# Altium schematic sheet 03_DUT_ICs.SchDoc
size A3; SheetNumber: 3; SheetTotal: 4
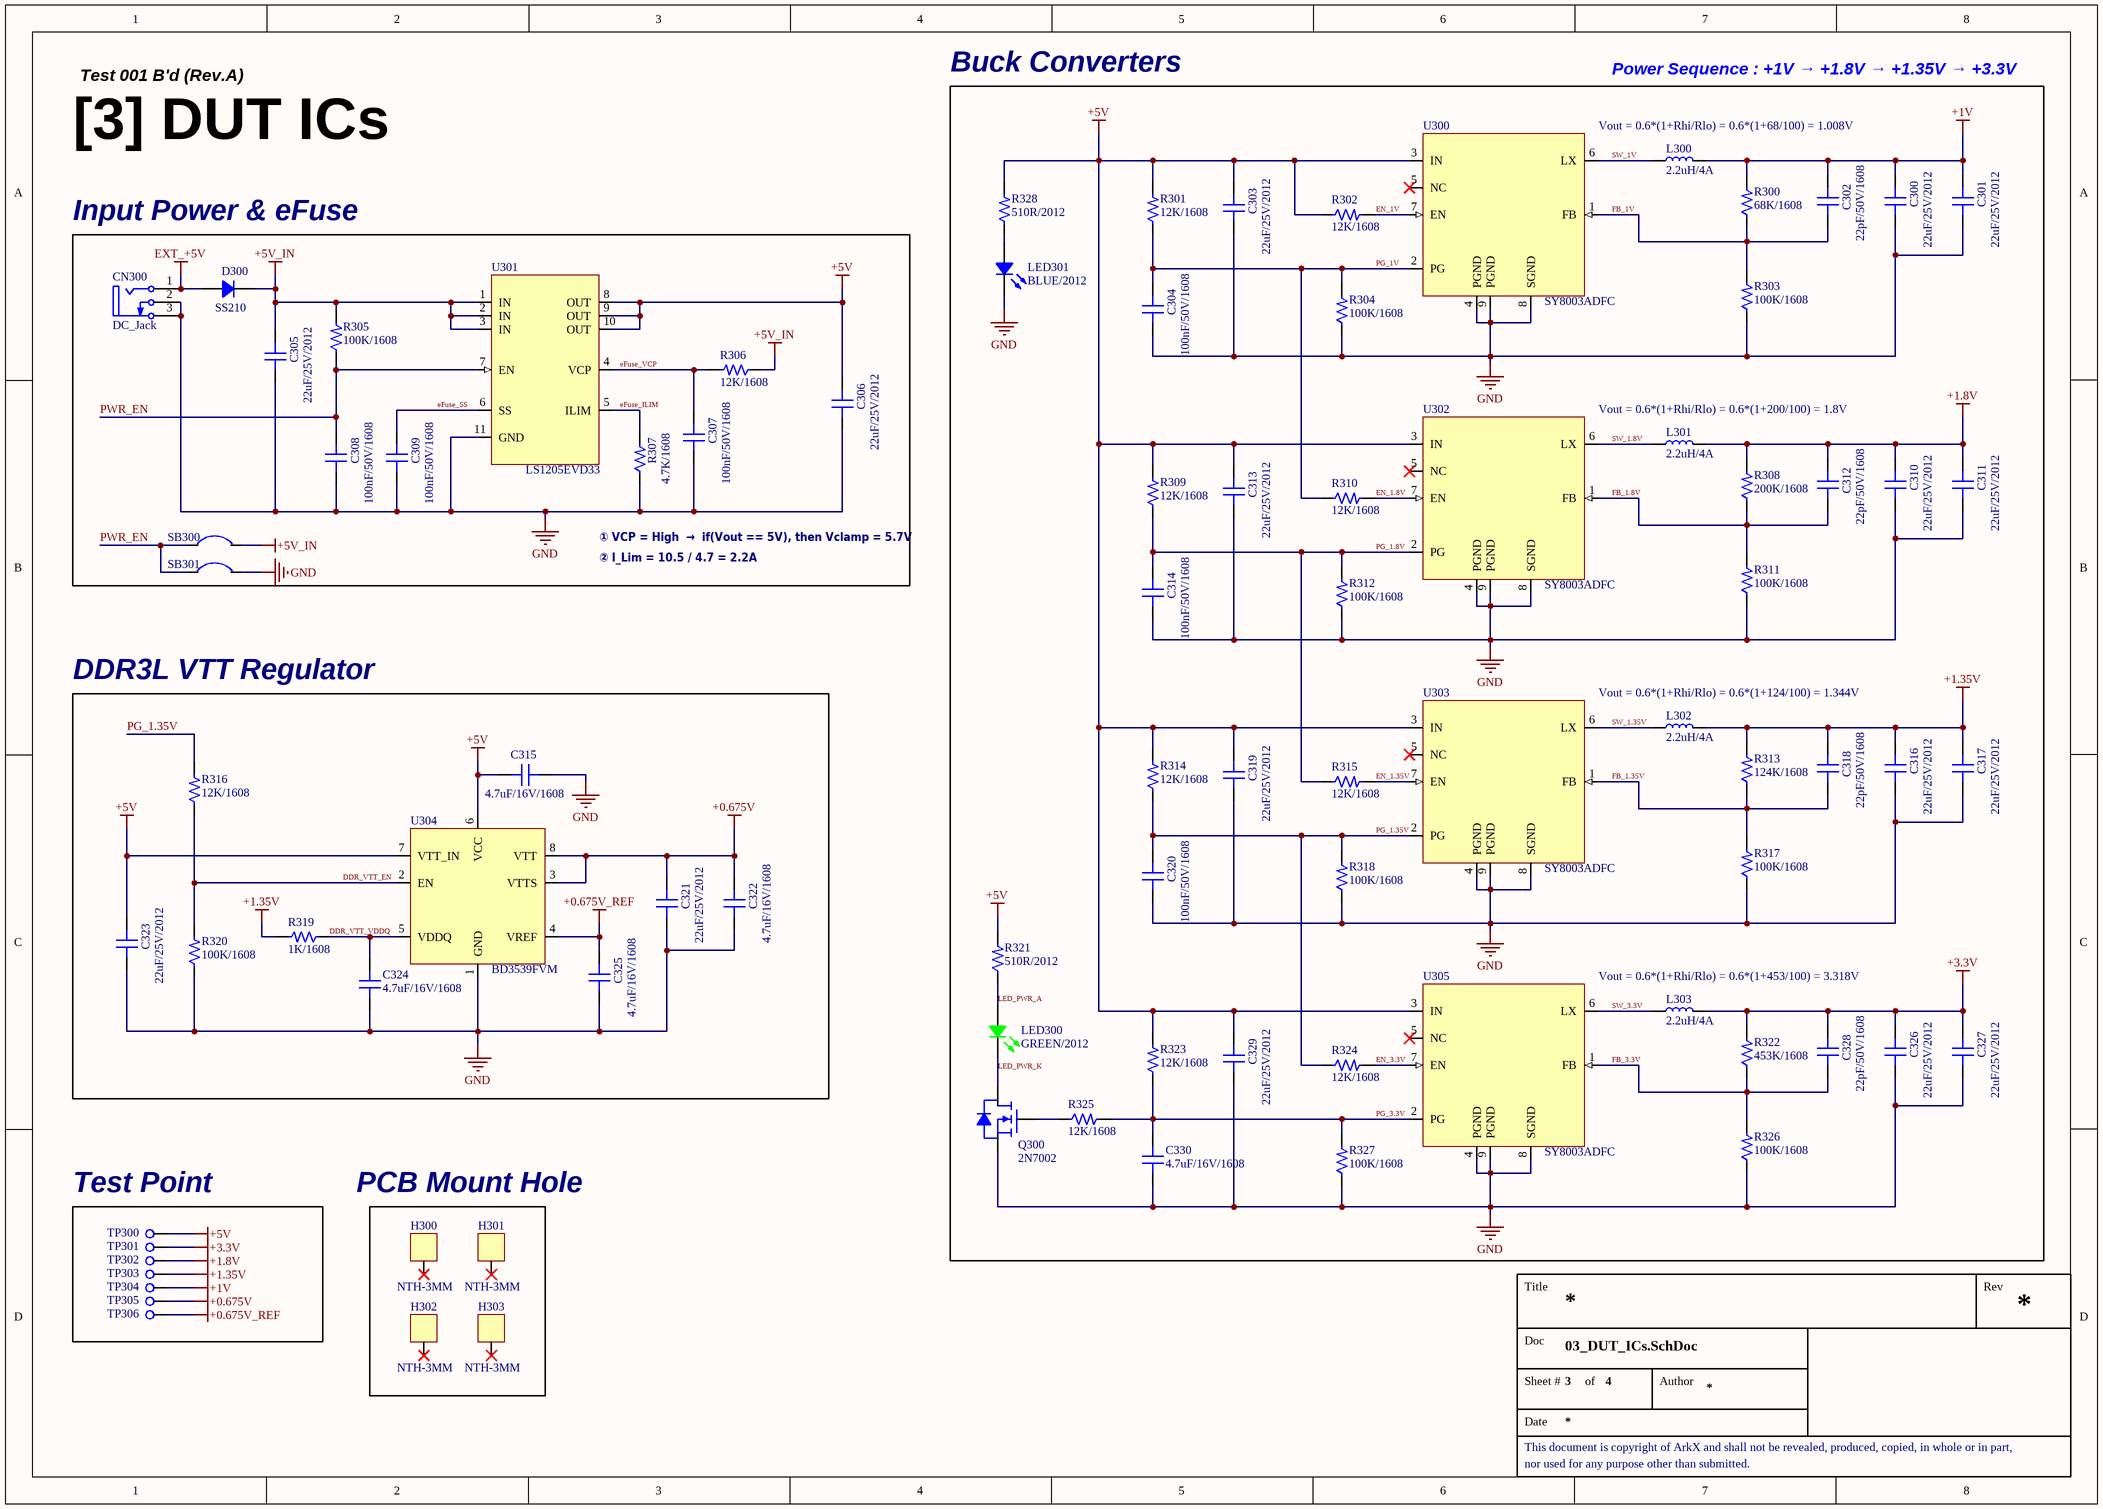
[diagram p0: 03_DUT_ICs.SchDoc]

## Parts
C300  22uF/25V/2012  [CAP 2012 (0805_INCH)]
C301  22uF/25V/2012  [CAP 2012 (0805_INCH)]
C302  22pF/50V/1608  [CAP 1608 (0603_INCH)]
C303  22uF/25V/2012  [CAP 2012 (0805_INCH)]
C304  100nF/50V/1608  [CAP 1608 (0603_INCH)]
C305  22uF/25V/2012  [CAP 2012 (0805_INCH)]
C306  22uF/25V/2012  [CAP 2012 (0805_INCH)]
C307  100nF/50V/1608  [CAP 1608 (0603_INCH)]
C308  100nF/50V/1608  [CAP 1608 (0603_INCH)]
C309  100nF/50V/1608  [CAP 1608 (0603_INCH)]
C310  22uF/25V/2012  [CAP 2012 (0805_INCH)]
C311  22uF/25V/2012  [CAP 2012 (0805_INCH)]
C312  22pF/50V/1608  [CAP 1608 (0603_INCH)]
C313  22uF/25V/2012  [CAP 2012 (0805_INCH)]
C314  100nF/50V/1608  [CAP 1608 (0603_INCH)]
C315  4.7uF/16V/1608  [CAP 1608 (0603_INCH)]
C316  22uF/25V/2012  [CAP 2012 (0805_INCH)]
C317  22uF/25V/2012  [CAP 2012 (0805_INCH)]
C318  22pF/50V/1608  [CAP 1608 (0603_INCH)]
C319  22uF/25V/2012  [CAP 2012 (0805_INCH)]
C320  100nF/50V/1608  [CAP 1608 (0603_INCH)]
C321  22uF/25V/2012  [CAP 2012 (0805_INCH)]
C322  4.7uF/16V/1608  [CAP 1608 (0603_INCH)]
C323  22uF/25V/2012  [CAP 2012 (0805_INCH)]
C324  4.7uF/16V/1608  [CAP 1608 (0603_INCH)]
C325  4.7uF/16V/1608  [CAP 1608 (0603_INCH)]
C326  22uF/25V/2012  [CAP 2012 (0805_INCH)]
C327  22uF/25V/2012  [CAP 2012 (0805_INCH)]
C328  22pF/50V/1608  [CAP 1608 (0603_INCH)]
C329  22uF/25V/2012  [CAP 2012 (0805_INCH)]
C330  4.7uF/16V/1608  [CAP 1608 (0603_INCH)]
CN300  DC_Jack  [CON DC-Jack]
D300  SS210  [DIO DO-214AC (SMA)]
H300  NTH-3MM  [HOLE NTH-3MM]
H301  NTH-3MM  [HOLE NTH-3MM]
H302  NTH-3MM  [HOLE NTH-3MM]
H303  NTH-3MM  [HOLE NTH-3MM]
L300  2.2uH/4A  [IND BWVS006060282R2M00]
L301  2.2uH/4A  [IND BWVS006060282R2M00]
L302  2.2uH/4A  [IND BWVS006060282R2M00]
L303  2.2uH/4A  [IND BWVS006060282R2M00]
LED300  GREEN/2012  [LED MHT170RGBCT (GREEN)]
LED301  BLUE/2012  [LED MHT170RGBCT (BLUE)]
Q300  2N7002  [SOT 23-3 (DIODES INCORPORATED)]
R300  68K/1608  [RES 1608 (0603_inch)]
R301  12K/1608  [RES 1608 (0603_inch)]
R302  12K/1608  [RES 1608 (0603_inch)]
R303  100K/1608  [RES 1608 (0603_inch)]
R304  100K/1608  [RES 1608 (0603_inch)]
R305  100K/1608  [RES 1608 (0603_inch)]
R306  12K/1608  [RES 1608 (0603_inch)]
R307  4.7K/1608  [RES 1608 (0603_inch)]
R308  200K/1608  [RES 1608 (0603_inch)]
R309  12K/1608  [RES 1608 (0603_inch)]
R310  12K/1608  [RES 1608 (0603_inch)]
R311  100K/1608  [RES 1608 (0603_inch)]
R312  100K/1608  [RES 1608 (0603_inch)]
R313  124K/1608  [RES 1608 (0603_inch)]
R314  12K/1608  [RES 1608 (0603_inch)]
R315  12K/1608  [RES 1608 (0603_inch)]
R316  12K/1608  [RES 1608 (0603_inch)]
R317  100K/1608  [RES 1608 (0603_inch)]
R318  100K/1608  [RES 1608 (0603_inch)]
R319  1K/1608  [RES 1608 (0603_inch)]
R320  100K/1608  [RES 1608 (0603_inch)]
R321  510R/2012  [RES 2012 (0805_inch)]
R322  453K/1608  [RES 1608 (0603_inch)]
R323  12K/1608  [RES 1608 (0603_inch)]
R324  12K/1608  [RES 1608 (0603_inch)]
R325  12K/1608  [RES 1608 (0603_inch)]
R326  100K/1608  [RES 1608 (0603_inch)]
R327  100K/1608  [RES 1608 (0603_inch)]
R328  510R/2012  [RES 2012 (0805_inch)]
SB300  SB  [SB (Solder-Bridge)]  (value not drawn)
SB301  SB  [SB (Solder-Bridge)]  (value not drawn)
TP300  TP_CIRCLE  [TP Circle]  (value not drawn)
TP301  TP_CIRCLE  [TP Circle]  (value not drawn)
TP302  TP_CIRCLE  [TP Circle]  (value not drawn)
TP303  TP_CIRCLE  [TP Circle]  (value not drawn)
TP304  TP_CIRCLE  [TP Circle]  (value not drawn)
TP305  TP_CIRCLE  [TP Circle]  (value not drawn)
TP306  TP_CIRCLE  [TP Circle]  (value not drawn)
U300  SY8003ADFC  [IC_DFN_2X2_8L]
U301  LS1205EVD33  [IC_DFN_3x3_10L]
U302  SY8003ADFC  [IC_DFN_2X2_8L]
U303  SY8003ADFC  [IC_DFN_2X2_8L]
U304  BD3539FVM  [IC_MSOP-8]
U305  SY8003ADFC  [IC_DFN_2X2_8L]

## Blocks framed on the sheet
Buck Converters: C300-C304 C310-C314 C316-C320 C326-C330 L300-L303 LED300 LED301 Q300 R300-R304 R308-R315 R317 R318 R321-R328 U300 U302 U303 U305
Input Power & eFuse: C305-C309 CN300 D300 R305-R307 SB300 SB301 U301
DDR3L VTT Regulator: C315 C321-C325 R316 R319 R320 U304
Test Point: TP300-TP306

## Nets
+0.675V: C321.2 C322.2 TP305.1(TP) U304.3(VTTS) U304.8(VTT)
+0.675V_REF: C325.2 TP306.1(TP) U304.4(VREF)
+1.8V: C310.2 C311.2 C312.2 L301.2 R308.2 TP302.1(TP)
+1.35V: C316.2 C317.2 C318.2 L302.2 R313.2 R319.2 TP303.1(TP)
+1V: C300.2 C301.2 C302.2 L300.2 R300.2 TP304.1(TP)
+3.3V: C326.2 C327.2 C328.2 L303.2 R322.2 TP301.1(TP)
+5V: C303.2 C306.2 C313.2 C315.2 C319.2 C323.2 C329.2 R301.2 R302.1 R309.2 R314.2 R321.2 R323.2 R328.2 TP300.1(TP) U300.3(IN) U301.8(OUT) U301.9(OUT) U301.10(OUT) U302.3(IN) U303.3(IN) U304.6(VCC) U304.7(VTT_IN) U305.3(IN)
+5V_IN: C305.2 D300.2 R305.2 R306.1 SB300.2 U301.1(IN) U301.2(IN) U301.3(IN)
EXT_+5V: CN300.1(VCC) D300.1
GND: C300.1 C301.1 C303.1 C304.1 C305.1 C306.1 C307.1 C308.1 C309.1 C310.1 C311.1 C313.1 C314.1 C315.1 C316.1 C317.1 C319.1 C320.1 C321.1 C322.1 C323.1 C324.1 C325.1 C326.1 C327.1 C329.1 C330.1 CN300.2(GND) CN300.3(GND) LED301.3(BLUE) Q300.2(S) R303.1 R304.1 R307.1 R311.1 R312.1 R317.1 R318.1 R320.1 R326.1 R327.1 SB301.2 U300.4(PGND) U300.8(SGND) U300.9(PGND) U301.11(GND) U302.4(PGND) U302.8(SGND) U302.9(PGND) U303.4(PGND) U303.8(SGND) U303.9(PGND) U304.1(GND) U305.4(PGND) U305.8(SGND) U305.9(PGND)
DDR_VTT_EN: R316.1 R320.2 U304.2(EN)
DDR_VTT_VDDQ: C324.2 R319.1 U304.5(VDDQ)
eFuse_ILIM: R307.2 U301.5(ILIM)
eFuse_SS: C309.2 U301.6(SS)
eFuse_VCP: C307.2 R306.2 U301.4(VCP)
EN_1.8V: R310.2 U302.7(EN)
EN_1.35V: R315.2 U303.7(EN)
EN_1V: R302.2 U300.7(EN)
EN_3.3V: R324.2 U305.7(EN)
FB_1.8V: C312.1 R308.1 R311.2 U302.1(FB)
FB_1.35V: C318.1 R313.1 R317.2 U303.1(FB)
FB_1V: C302.1 R300.1 R303.2 U300.1(FB)
FB_3.3V: C328.1 R322.1 R326.2 U305.1(FB)
LED_PWR_A: LED300.4(Common_Anode) R321.1
LED_PWR_K: LED300.2(GREEN) Q300.3(D)
PG_1.8V: C314.2 R309.1 R312.2 R315.1 U302.2(PG)
PG_1.35V: C320.2 R314.1 R316.2 R318.2 R324.1 U303.2(PG)
PG_1V: C304.2 R301.1 R304.2 R310.1 U300.2(PG)
PG_3.3V: C330.2 R323.1 R325.2 R327.2 U305.2(PG)
PWR_EN: C308.2 R305.1 SB300.1 SB301.1 U301.7(EN)
SW_1.8V: L301.1 U302.6(LX)
SW_1.35V: L302.1 U303.6(LX)
SW_1V: L300.1 U300.6(LX)
SW_3.3V: L303.1 U305.6(LX)
NetLED301_4: LED301.4(Common_Anode) R328.1
NetQ300_1: Q300.1(G) R325.1

Not connected (* = marked no-connect by the designer): H300 1*; H301 1*; H302 1*; H303 1*; U300 5(NC)*; U302 5(NC)*; U303 5(NC)*; U305 5(NC)*

## Notes on the sheet
- Test 001 B'd (Rev.A)
- Power Sequence : +1V → +1.8V → +1.35V → +3.3V
- [3] DUT ICs
- Vout = 0.6*(1+Rhi/Rlo) = 0.6*(1+68/100) = 1.008V
- Vout = 0.6*(1+Rhi/Rlo) = 0.6*(1+200/100) = 1.8V
- ① VCP = High  →  if(Vout == 5V), then Vclamp = 5.7V
- ② I_Lim = 10.5 / 4.7 = 2.2A
- Vout = 0.6*(1+Rhi/Rlo) = 0.6*(1+124/100) = 1.344V
- Vout = 0.6*(1+Rhi/Rlo) = 0.6*(1+453/100) = 3.318V
- PCB Mount Hole
- Title
- Rev
- Doc
- Sheet #
- of
- Author
- This document is copyright of ArkX and shall not be revealed, produced, copied, in whole or in part,
- Date
- nor used for any purpose other than submitted.

## Library data of the parts
C300 C301 C303 C305 C306 C310 C311 C313 C316 C317 C319 C321 C323 C326 C327 C329 = CAP_22uF/25V/2012: Ceramic CAP_22uF/25V/2012; LCSC Part #: C45783; JLCPCB Part Type: Basic Part
C302 C312 C318 C328 = CAP_22pF/50V/1608: Ceramic CAP_22pF/50V/1608; LCSC Part #: C1653; JLCPCB Part Type: Basic Part
C304 C307-C309 C314 C320 = CAP_100nF/50V/1608: Ceramic CAP_100nF/50V/1608; LCSC Part #: C14663; JLCPCB Part Type: Basic Part
C315 C322 C324 C325 C330 = CAP_4.7uF/16V/1608: Ceramic CAP_4.7uF/16V/1608; LCSC Part #: C19666; JLCPCB Part Type: Basic Part
CN300 = CON_DC-Jack: ComponentLink1Description: Manufacturer Link; ComponentLink1URL: http://www.cliffuk.co.uk/
D300 = DIO_SS210: 100V 850mV@2A 2A SMA(DO-214AC)  Schottky Barrier Diodes (SBD) ROHS; LCSC Part #: C14996; JLCPCB Part Type: Basic Part
H300-H303 = HOLE_NTH-3MM: Non-Through Hole 3mm
L300-L303 = IND_BWVS006060282R2M00: FIXED IND 2.2uH 4A 20mohm SMD; Supplier 1: Digi-Key; Supplier 2: Mouser
LED300 = LED_MHT170RGBCT(GREEN): Colorless transparence -30℃~+85℃ Positive post Common anode RGB 120° 0805  Light Emitting Diodes (LED) ROHS; LCSC Part #: C2962094; JLCPCB Part Type: Extended Part
LED301 = LED_MHT170RGBCT(BLUE): Colorless transparence -30℃~+85℃ Positive post Common anode RGB 120° 0805  Light Emitting Diodes (LED) ROHS; LCSC Part #: C2962094; JLCPCB Part Type: Extended Part
Q300 = FET_2N7002: 60V 115mA 200mW 7.5Ω@10V,500mA N Channel SOT-23  MOSFETs ROHS; LCSC Part #: C8545; JLCPCB Part Type: Basic Part
R300 = RES_68K/1608/0.1W: Value: 68K; Power Rating: 0.1W; Precision: 1%; Size: 1608; LCSC Part #: C23231; JLCPCB Part Type: Basic Part
R301 R302 R306 R309 R310 R314-R316 R323-R325 = RES_12K/1608/0.1W: Value: 12K; Power Rating: 0.1W; Precision: 1%; Size: 1608; LCSC Part #: C22790; JLCPCB Part Type: Basic Part
R303-R305 R311 R312 R317 R318 R320 R326 R327 = RES_100K/1608/0.1W: Value: 100K; Power Rating: 0.1W; Precision: 1%; Size: 1608; LCSC Part #: C25803; JLCPCB Part Type: Basic Part
R307 = RES_4.7K/1608/0.1W: Value: 4.7K; Power Rating: 0.1W; Precision: 1%; Size: 1608; LCSC Part #: C23162; JLCPCB Part Type: Basic Part
R308 = RES_200K/1608/0.1W: Value: 200K; Power Rating: 0.1W; Precision: 1%; Size: 1608; LCSC Part #: C25811; JLCPCB Part Type: Basic Part
R313 = RES_124K/1608/0.1W: Value: 124K; Power Rating: 0.1W; Precision: 1%; Size: 1608; LCSC Part #: C140118; JLCPCB Part Type: Extended Part
R319 = RES_1K/1608/0.1W: Value: 1K; Power Rating: 0.1W; Precision: 1%; Size: 1608; LCSC Part #: C21190; JLCPCB Part Type: Basic Part
R321 R328 = RES_510R/2012/0.125W: Value: 510R; Power Rating: 0.125W; Precision: 1%; Size: 2012; LCSC Part #: C17734; JLCPCB Part Type: Basic Part
R322 = RES_453K/1608/0.1W: Value: 453K; Power Rating: 0.1W; Precision: 1%; Size: 1608; LCSC Part #: C25818; JLCPCB Part Type: Extended Part
SB300 SB301 = SB_Solder-Bridge
U300 U302 U303 U305 = IC_REG_SY8003ADFC: High Efficiency 5.5V, 3A Continuous, 1MHz Synchronous Step Down Regulator; Manufacturer: Silergy; Manufacturer Part Number: High Efficiency 5.5V, 3A continuous, 1MHz; JLCPCB Part Type: Extended Part; LCSC Part #: C178236
U301 = IC_eFUSE_LS1205EVD33: 18V, 5A eFuse with Programmable Current Limit and Output Voltage Clamp, 10-DFN (3x3)
U304 = IC_REG_VTT_BD3539FVM: 1.0V to 5.5V, 1A 1ch / Termination Regulators for DDR-SDRAMs, 8-MSOP